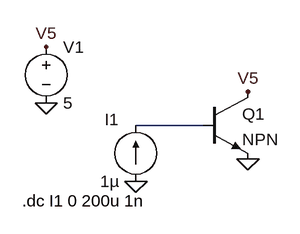
[diagram p0: schematic BF241test.asc]
BF241test.asc, the LTspice schematic file:
Version 4
SHEET 1 880 680
WIRE 144 256 48 256
FLAG 208 304 0
FLAG 208 208 V5
FLAG -80 224 0
FLAG -80 144 V5
FLAG 48 336 0
SYMBOL npn 144 208 R0
SYMATTR InstName Q1
SYMBOL voltage -80 128 R0
WINDOW 123 0 0 Left 0
WINDOW 39 0 0 Left 0
SYMATTR InstName V1
SYMATTR Value 5
SYMBOL current 48 336 R180
WINDOW 0 24 88 Left 0
WINDOW 3 24 0 Left 0
WINDOW 123 0 0 Left 0
WINDOW 39 0 0 Left 0
SYMATTR InstName I1
SYMATTR Value 1µ
TEXT -114 364 Left 0 !.dc I1 0 200u 1n

The netlist it stands for:
* BF241test.asc
Q1 V5 N001 0 0 NPN
V1 V5 0 5
I1 0 N001 1µ
.model NPN NPN
.model PNP PNP
.lib standard.bjt
.dc I1 0 200u 1n
.backanno
.end